# Altium schematic sheet SERIAL-CHIP.SchDoc
size A4; SheetNumber: 5; SheetTotal: 7
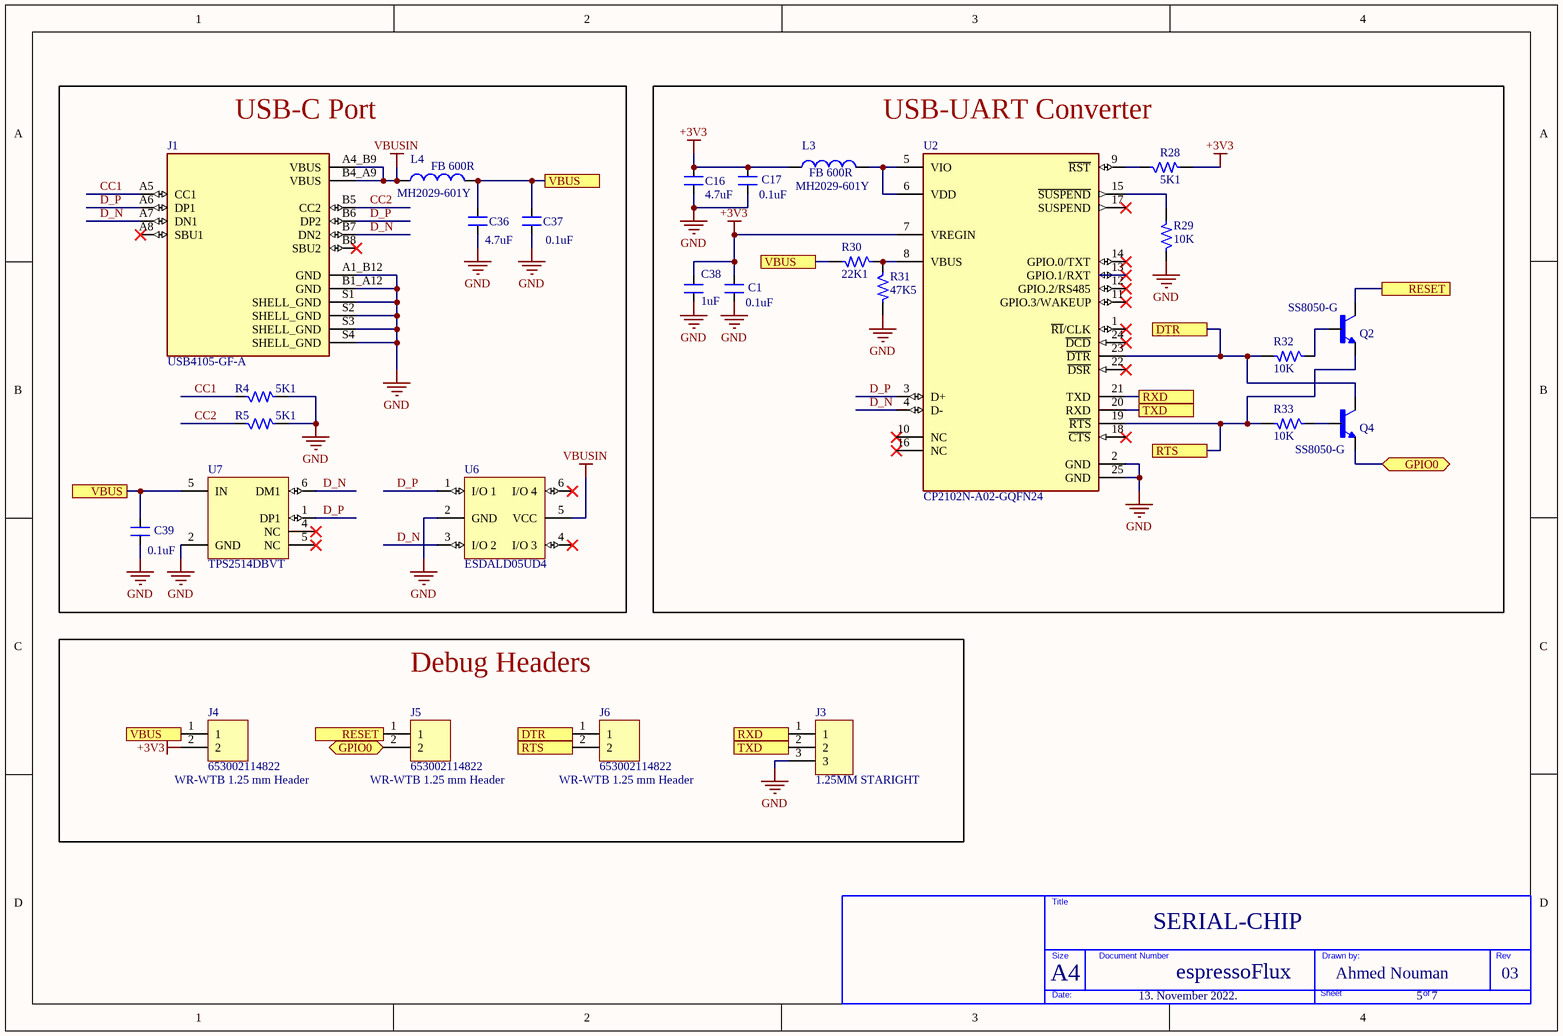
[diagram p0: SERIAL-CHIP.SchDoc]

## Parts
?  (no value)  (graphical)
C1  0.1uF  [CAP_0805]
C16  4.7uF  [CAP_0805]
C17  0.1uF  [CAP_0805]
C36  4.7uF  [CAP_0805]
C37  0.1uF  [CAP_0805]
C38  1uF  [CAP_0805]
C39  0.1uF  [CAP_0805]
J1  USB4105-GF-A  [CON_USB_C_USB2.0_USB4105-GF-A]
J3  1.25MM STARIGHT  [CON3_probing_1.25mm]
J4  653002114822  [CON2_probing_1.25mm]
J5  653002114822  [CON2_probing_1.25mm]
J6  653002114822  [CON2_probing_1.25mm]
L3  MH2029-601Y  [INDC2012N]
L4  MH2029-601Y  [INDC2012N]
Q2  SS8050-G  [TRANS_NPN_SS8050-G]
Q4  SS8050-G  [TRANS_NPN_SS8050-G]
R4  5K1  [RES_0805]
R5  5K1  [RES_0805]
R28  5K1  [RES_0805]
R29  10K  [RES_0805]
R30  22K1  [RES_0805]
R31  47K5  [RES_0805]
R32  10K  [RES_0805]
R33  10K  [RES_0805]
U2  CP2102N-A02-GQFN24  [QFN24-4X4]
U6  ESDALD05UD4  [SOT26A-6N]
U7  TPS2514DBVT  [SOT26A-6N]

## Blocks framed on the sheet
USB-C Port: C36 C37 C39 J1 L4 R4 R5 U6 U7
USB-UART Converter: C1 C16 C17 C38 L3 Q2 Q4 R28-R33 U2
Debug Headers: J3-J6

## Ports
DTR, GPIO0 (bidir), RESET, RTS, RXD, TXD, VBUS

## Nets
+3V3: C1.2 C16.2 C17.2 C38.2 J4.2 L3.1 R28.2 U2.7(VREGIN)
GND: C1.1 C16.1 C17.1 C36.1 C37.1 C38.1 C39.1 J1.A1_B12(GND) J1.B1_A12(GND) J1.S1(SHELL_GND) J1.S2(SHELL_GND) J1.S3(SHELL_GND) J1.S4(SHELL_GND) J3.3 R4.2 R5.2 R29.1 R31.2 U2.2(GND) U2.25(GND) U6.2(GND) U7.2(GND)
VBUSIN: J1.A4_B9(VBUS) J1.B4_A9(VBUS) L4.1 U6.5(VCC)
CC1: J1.A5(CC1) R4.1
CC2: J1.B5(CC2) R5.1
D_N: J1.A7(DN1) J1.B7(DN2) U2.4(D-) U6.3(I/O_2) U7.6(DM1)
D_P: J1.A6(DP1) J1.B6(DP2) U2.3(D+) U6.1(I/O_1) U7.1(DP1)
DTR: J6.1 Q4.3(C) R32.2 U2.23(~{DTR}) ; port DTR
GPIO0: J5.2 Q4.2(E) ; port GPIO0
RESET: J5.1 Q2.3(C) ; port RESET
RTS: J6.2 Q2.2(E) R33.2 U2.19(~{RTS}) ; port RTS
RXD: J3.1 U2.21(TXD) ; port RXD
TXD: J3.2 U2.20(RXD) ; port TXD
VBUS: C36.2 C37.2 C39.2 J4.1 L4.2 R30.2 U7.5(NC) ; port VBUS
NetL3_2: L3.2 U2.5(VIO) U2.6(VDD)
NetQ2_1: Q2.1(B) R32.1
NetQ4_1: Q4.1(B) R33.1
NetR28_1: R28.1 U2.9(~{RST})
NetR29_2: R29.2 U2.15(~{SUSPEND})
NetR30_1: R30.1 R31.1 U2.8(VBUS)

Not connected (* = marked no-connect by the designer): J1 A8(SBU1)* B8(SBU2)*; U2 1(~{RI}/CLK)* 10(NC)* 11(GPIO.3/WAKEUP)* 12(GPIO.2/RS485)* 13(GPIO.1/RXT)* 14(GPIO.0/TXT)* 16(NC)* 17(SUSPEND)* 18(~{CTS})* 22(~{DSR})* 24(~{DCD})*; U6 4(I/O_3)* 6(I/O_4)*; U7 4(NC)*

## Notes on the sheet
- (near L4) FB 600R
- (near L3) FB 600R
- (near J4) WR-WTB 1.25 mm Header
- (near J5) WR-WTB 1.25 mm Header
- (near J6) WR-WTB 1.25 mm Header
- A4
- SERIAL-CHIP
- espressoFlux
- Ahmed Nouman
- 03
- 13. November 2022.
- 5   7
- Title
- Size
- Document Number
- Drawn by:
- Rev
- Date:
- Sheet
- of

## Library data of the parts
? = TITLE BLOCK_BLANK
C1 C17 C37 C39 = CAP_0.1uF-50V-10%-0805: 0.1µF ±10% 50V Ceramic Capacitor X7R 0805 (2012 Metric); Manufacturer: Samsung; Manufacturer Part Number: CL21B104KBCNNNC; Alternate Part Number-1: NA; Case/Package: 0805; Supplier-1: SIRICOM; Supplier Part Number-1: 0805B104K500CT
C16 C36 = CAP_1uF-50V-10%-0805_1: 4.7µF ±10% 50V Ceramic Capacitor X7R 0805 (2012 Metric); Manufacturer: Samsung; Manufacturer Part Number: CL21B104KBCNNNC; Alternate Part Number-1: NA; Case/Package: 0805; Supplier-1: SIRICOM; Supplier Part Number-1: 0805B104K500CT
C38 = CAP_1uF-50V-10%-0805_1: 1µF ±10% 50V Ceramic Capacitor X7R 0805 (2012 Metric); Manufacturer: Samsung; Manufacturer Part Number: CL21B104KBCNNNC; Alternate Part Number-1: NA; Case/Package: 0805; Supplier-1: SIRICOM; Supplier Part Number-1: 0805B104K500CT
J1 = CON_USB_C_USB2.0_USB4105-GF-A
J3 = CON-3-1.25MM-PROBING: 3 Pins, 1 Row 1.25mm Pitch, straight Connector, male; Manufacturer Part Number: 653003114822; Manufacturer: WURTH; Mating Part Number: 653003113322; Crimp Part Number: 653153128130; Alternate Part Number-1: NA; Case/Package: TH-CON; Supplier-1: WURTH; Supplier Part Number-1: 653003114822
J4-J6 = CON-2-1.25MM-PROPING: 2 Pins, 1 Row 1.25mm Pitch, Straight Connector, male; Manufacturer: JST; Mating Part Number: 653002113322; Crimp Part Number: 653153128130; Alternate Part Number-1: NA; Manufacturer Part Number: 653002114822; Case/Package: TH-CON; Supplier-1: WURTH; Supplier Part Number-1: 653002114822
L3 L4 = Inductor: Code_IEC: 1005; Value: MPZ1608S601A; Published: 8-Jun-2000; LatestRevisionDate: 17-Jul-2002; LatestRevisionNote: Re-released for DXP Platform.; PackageReference: 0402-A; Publisher: Altium Limited; Code_JEITA: 0402
Q2 Q4 = TRANS_NPN_SS8050-G: Bipolar (BJT) Transistor NPN 25 V 1.5 A 100MHz 300 mW Surface Mount SOT-23-3
R4 R5 R28 = RES_5.1K-0.125W-1%-0805: 5.1 kOhms ±1% 0.125W, 1/8W Chip Resistor 0805 (2012 Metric) Moisture Resistant Thick Film; Manufacturer: Stackpole Electronics; Manufacturer Part Number: RC0805FR-075K9L; Alternate Part Number-1: NA; Case/Package: 0805; Supplier-1: SIRICOM; Supplier Part Number-1: WR08X5901FTL
R29 R32 R33 = RES_10K-0.125W-1%-0805: 10 kOhms ±1% 0.125W, 1/8W Chip Resistor 0805 (2012 Metric) Automotive AEC-Q200 Thick Film; Manufacturer: CTS; Manufacturer Part Number: WR08X1002FTL; Case/Package: 0805; Supplier-1: SIRICOM; Supplier Part Number-1: WR08X1002FTL; Alternate Part Number-1: WR08X1002FTL
R30 = RES_5.1K-0.125W-1%-0805: 22K1 kOhms ±1% 0.125W, 1/8W Chip Resistor 0805 (2012 Metric) Moisture Resistant Thick Film; Manufacturer: Stackpole Electronics; Manufacturer Part Number: RC0805FR-075K9L; Alternate Part Number-1: NA; Case/Package: 0805; Supplier-1: SIRICOM; Supplier Part Number-1: WR08X5901FTL
R31 = RES_5.1K-0.125W-1%-0805: 47K5 kOhms ±1% 0.125W, 1/8W Chip Resistor 0805 (2012 Metric) Moisture Resistant Thick Film; Manufacturer: Stackpole Electronics; Manufacturer Part Number: RC0805FR-075K9L; Alternate Part Number-1: NA; Case/Package: 0805; Supplier-1: SIRICOM; Supplier Part Number-1: WR08X5901FTL
U6 = D5V0P4UR6SO: 16V Clamp 5.5A (8/20µs) Ipp Tvs Diode Surface Mount SOT23-6L
U7 = TPS2514DBVT: USB Charging Port Controller SOT-23-6 Texas Instruments TPS2514DBVT, Battery Charge Controller, 35mA, 6-Pin SOT-23; Geometry.Height: 1.45mm; Manufacturer_Name: Texas Instruments; Manufacturer_Part_Number: TPS2514DBVT; Mouser Part Number: 595-TPS2514DBVT; Mouser Price/Stock: https://www.mouser.co.uk/ProductDetail/Texas-Instruments/TPS2514DBVT?qs=7GxONfNUZSgiiGlogi3JDg%3D%3D; Arrow Part Number: TPS2514DBVT; Arrow Price/Stock: https://www.arrow.com/en/products/tps2514dbvt/texas-instruments?region=nac; Mouser Testing Part Number: *; Mouser Testing Price/Stock: *; Datasheet Link: http://www.ti.com/lit/ds/symlink/tps2514.pdf